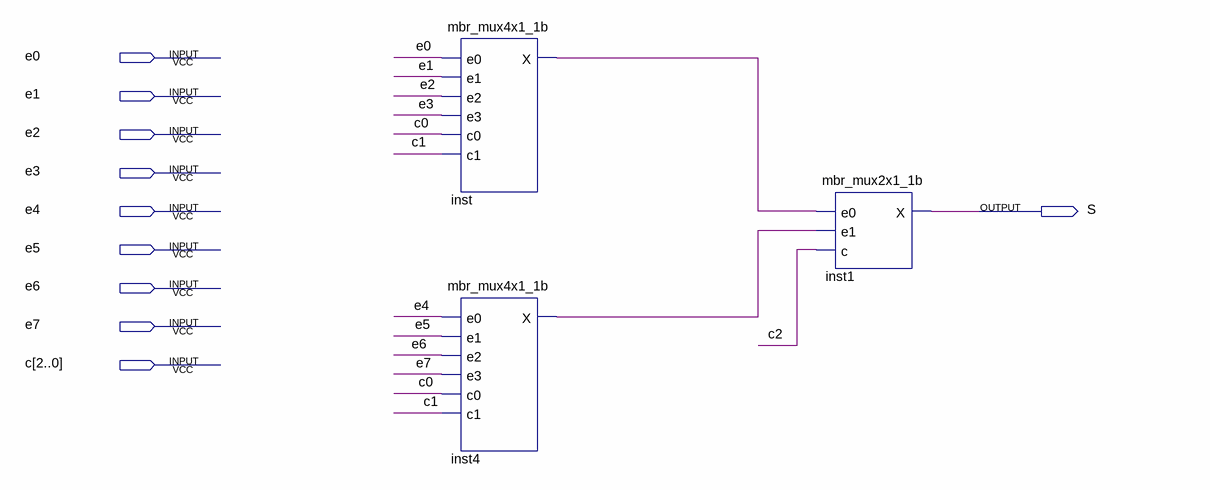
[diagram p0: schematic sheet]
// Quartus schematic mbr_mux8x1_1b.bdf as structural Verilog: 3 symbols, 10 pins
module mbr_mux8x1_1b (
  input  e0,
  input  e1,
  input  e2,
  input  e3,
  input  e4,
  input  e5,
  input  e6,
  input  e7,
  input  [2:0] c,
  output S
);

  wire inst4_x, inst_x;

  mbr_mux4x1_1b inst (.e0(e0), .e1(e1), .e2(e2), .e3(e3), .c0(c[0]), .c1(c[1]), .X(inst_x));
  mbr_mux4x1_1b inst4 (.e0(e4), .e1(e5), .e2(e6), .e3(e7), .c0(c[0]), .c1(c[1]), .X(inst4_x));
  mbr_mux2x1_1b inst1 (.e0(inst_x), .e1(inst4_x), .c(c[2]), .X(S));
endmodule
